# Altium schematic sheet nghichluu.SchDoc
size A
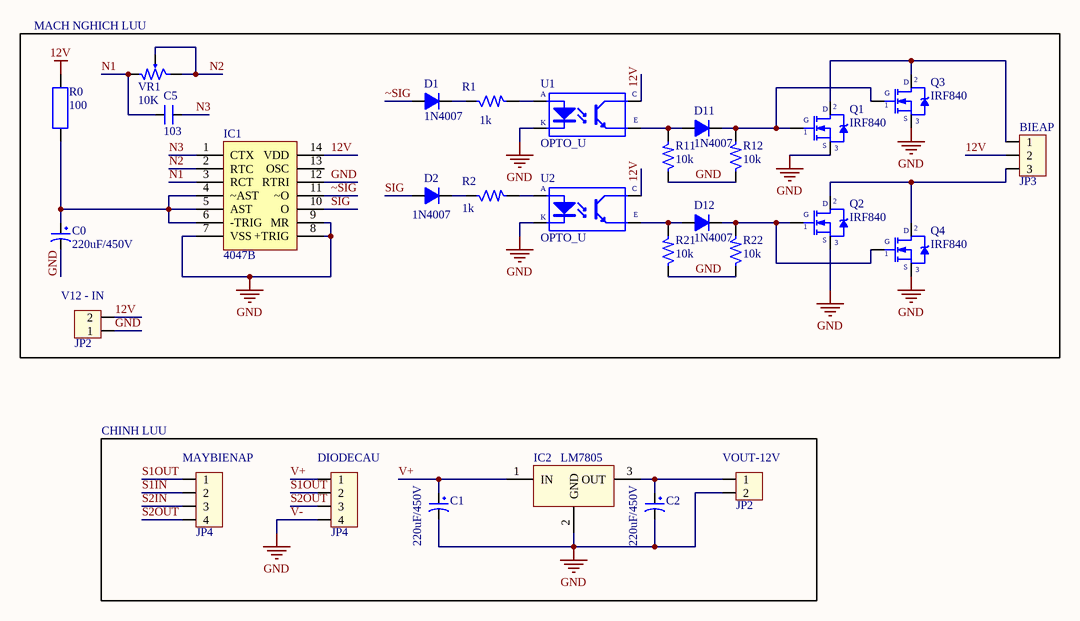
[diagram p0: nghichluu.SchDoc]

## Parts
BIEAP  JP3  [CON3]
C0  220uF/450V  [CP4.5/19]
C1  220uF/450V  [CP4.5/19]
C2  220uF/450V  [CP4.5/19]
C5  103  [SM-0805]
D1  1N4007  [D1A]
D2  1N4007  [D1A]
D11  1N4007  [D1A]
D12  1N4007  [D1A]
DIODECAU  JP4  [CON4]
IC1  4047B
IC2  LM7805  [QTO-220]
MAYBIENAP  JP4  [CON4]
Q1  IRF840  [QTO-220]
Q2  IRF840  [QTO-220]
Q3  IRF840  [QTO-220]
Q4  IRF840  [QTO-220]
R0  100  [R1W]
R1  1k  [R1/4W]
R2  1k  [R1/4W]
R11  10k  [R1/4W]
R12  10k  [R1/4W]
R21  10k  [R1/4W]
R22  10k  [R1/4W]
U1  OPTO_U  [OPTO_U]
U2  OPTO_U  [OPTO_U]
V12_-_IN  JP2  [CON2]
VOUT-12V  JP2  [CON2]
VR1  10K  [VR]

## Blocks framed on the sheet
MACH NGHICH LUU: BIEAP C0 C5 D1 D2 D11 D12 IC1 Q1-Q4 R0-R2 R11 R12 R21 R22 U1 U2 V12_-_IN VR1
CHINH LUU: C1 C2 DIODECAU IC2 MAYBIENAP VOUT-12V

## Nets
12V: BIEAP.2 IC1.14(VDD) R0.2 U1.C U2.C V12_-_IN.2
GND: C0.2 C1.2 C2.2 DIODECAU.4 IC1.7(VSS) IC1.8(+TRIG) IC1.9(MR) IC1.12(RTRI) IC2.2(GND) Q1.3(S) Q2.3(S) Q3.3(S) Q4.3(S) R11.1 R12.1 R21.1 R22.1 U1.K U2.K V12_-_IN.1 VOUT-12V.2  [also labelled V-]
N1: C5.1 IC1.3(RCT) VR1.1
N2: IC1.2(RTC) VR1.2 VR1.3
N3: C5.2 IC1.1(CTX)
S1IN: MAYBIENAP.2
S1OUT: DIODECAU.2 MAYBIENAP.1
S2IN: MAYBIENAP.3
S2OUT: DIODECAU.3 MAYBIENAP.4
SIG: D2.1(A) IC1.10(O)
V+: C1.1 DIODECAU.1 IC2.1(IN)
~SIG: D1.1(A) IC1.11(~O)
NetBIEAP_1: BIEAP.1 Q1.2(D) Q3.2(D)
NetBIEAP_3: BIEAP.3 Q2.2(D) Q4.2(D)
NetC0_1: C0.1 IC1.4(~AST) IC1.5(AST) IC1.6(-TRIG) R0.1
NetC2_1: C2.1 IC2.3(OUT) VOUT-12V.1
NetD1_2: D1.2(K) R1.1
NetD2_2: D2.2(K) R2.1
NetD11_1: D11.1(A) R11.2 U1.E
NetD11_2: D11.2(K) Q1.1(G) Q3.1(G) R12.2
NetD12_1: D12.1(A) R21.2 U2.E
NetD12_2: D12.2(K) Q2.1(G) Q4.1(G) R22.2
NetR1_2: R1.2 U1.A
NetR2_2: R2.2 U2.A

Not connected (* = marked no-connect by the designer): IC1 13(OSC)

## Library data of the parts
BIEAP = Con3: Connector 3; Value: Connector 3
C0-C2 = CP9: Cap 10000uF/63V; Value: 220uF/450V
C5 = CM: Cap SMD; Value: 103
D1 D2 D11 D12 = D1A: Diode 1A; Value: 1N4007
DIODECAU MAYBIENAP = Con4: Connector 4; Value: Connector 4
IC2 = LM78xx: On ap +, from + 5 to + 24VDC; Value: LM7805
Q1-Q4 = IRF840: MOSFET N - CHANNEL 500V - 0.75 - 8A - TO-220; Value: IRF840
R0 = R1W: Resistor 1W; Value: R1W - 100
R1 R2 R11 R12 R21 R22 = R: Resistor 1/4W; Value: R1/4W - 1K
U1 U2 = OPTO_U: Single Opto; Value: TLP5211
V12_-_IN VOUT-12V = Con2: Connector 2; Value: Connector 2
VR1 = VR1: Var Resistor; Value: VR 10K